# Altium project Offline-programmer-Hardware.PrjPcb
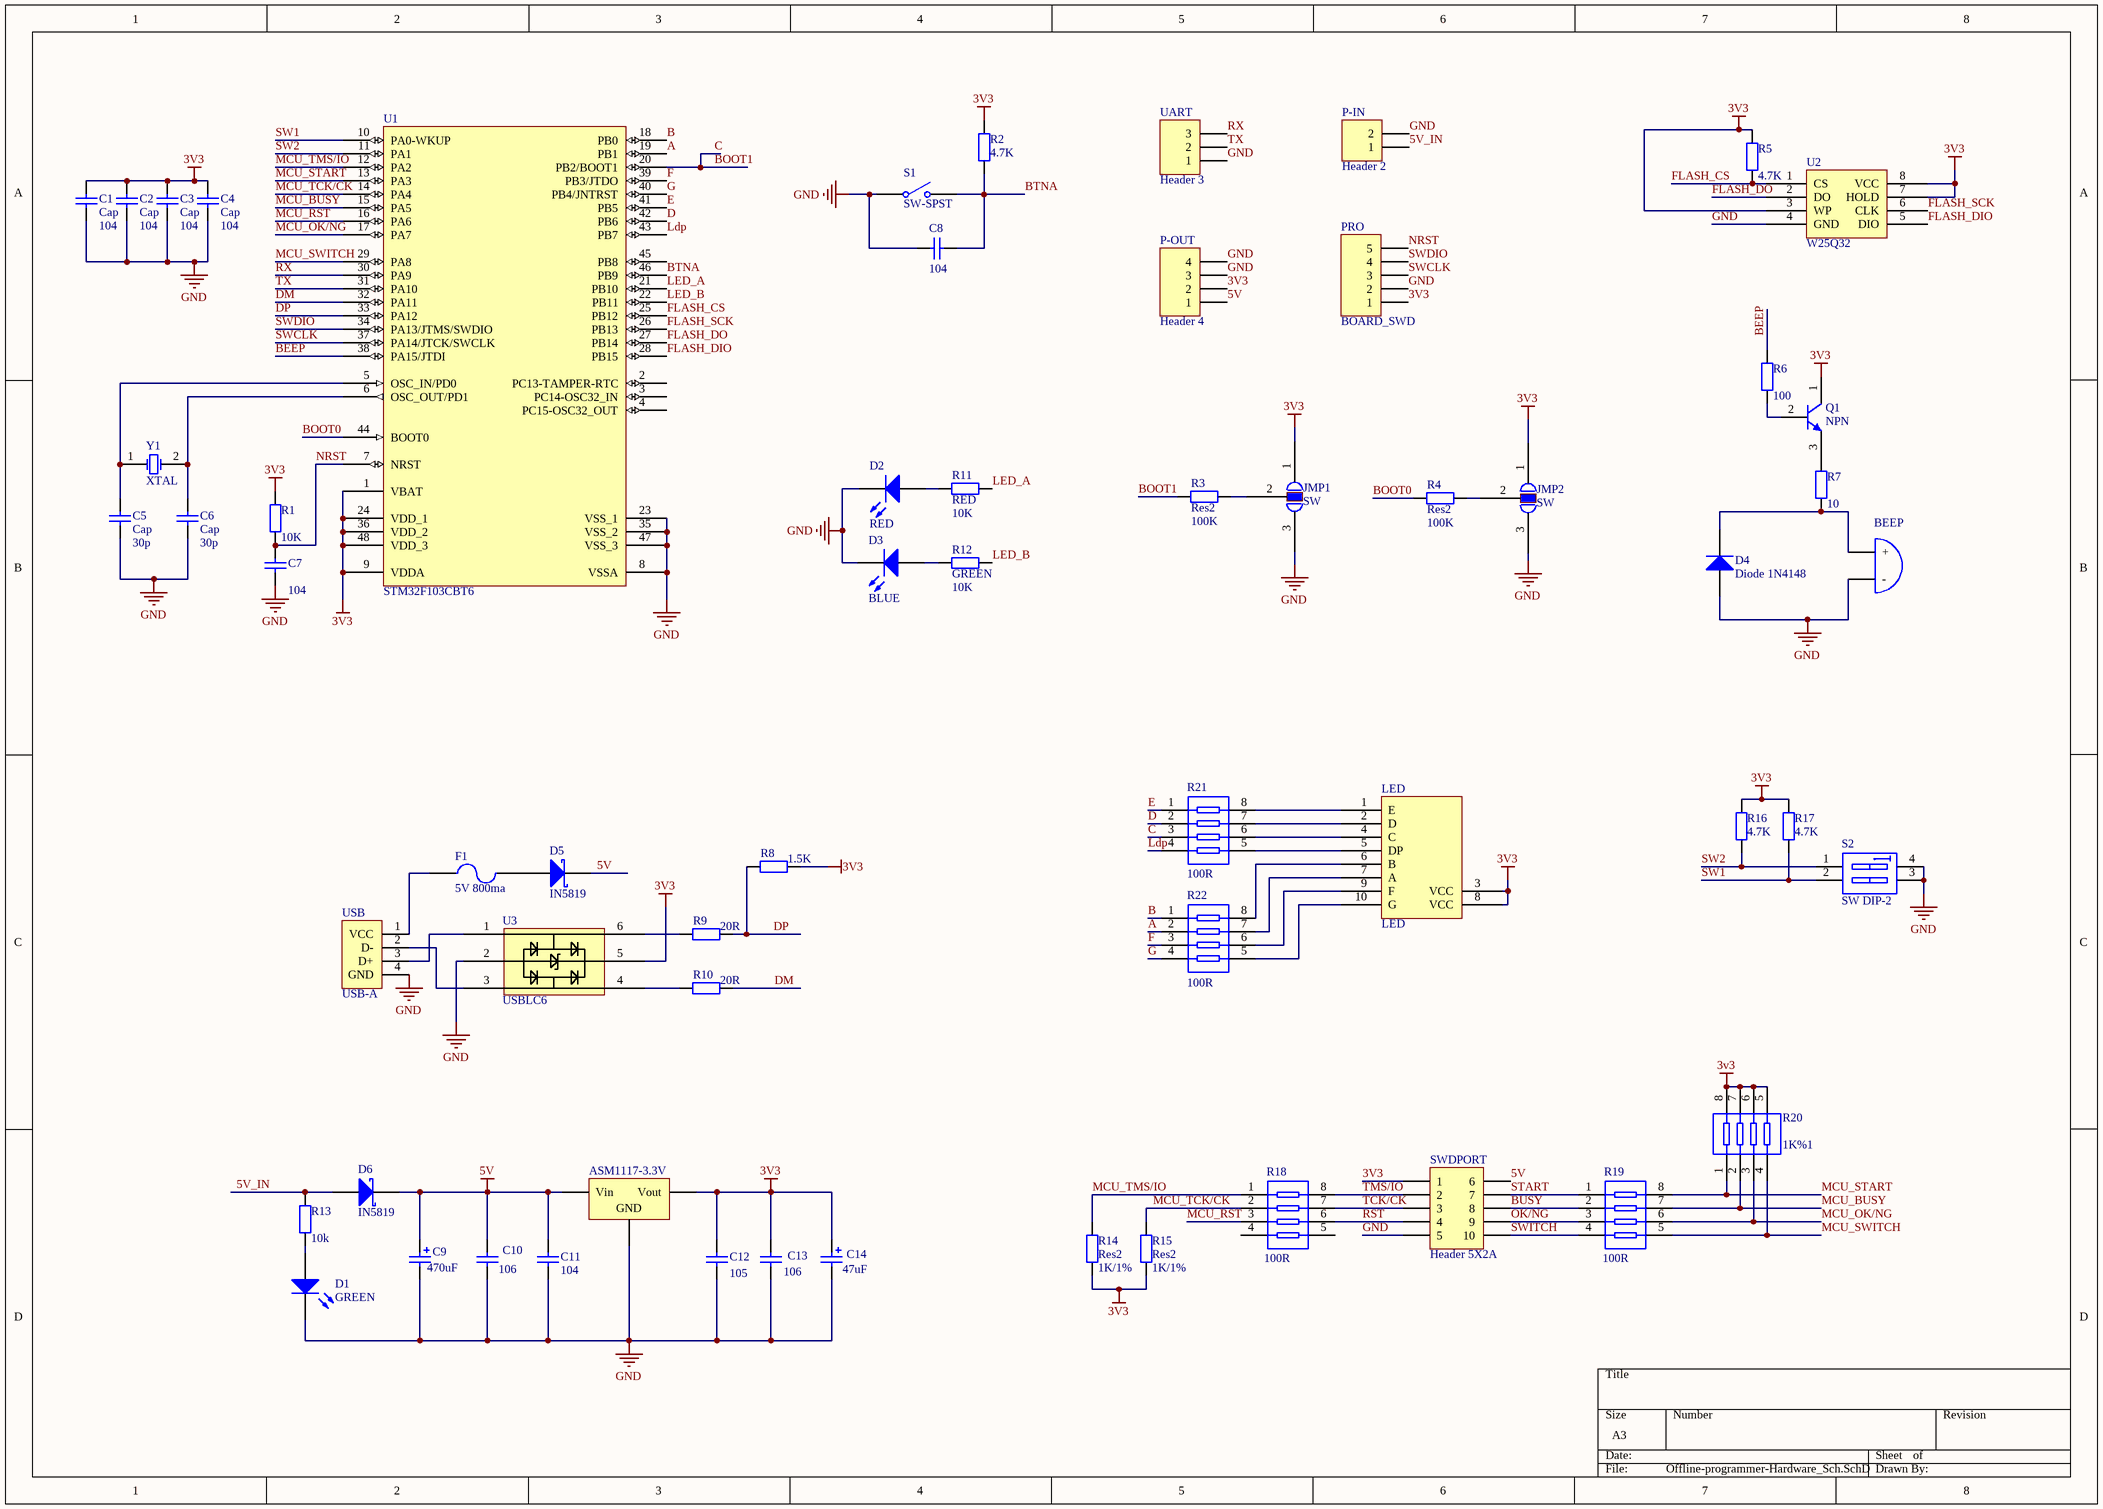
[diagram p0: Offline-programmer-Hardware_Sch.SchDoc]
1 sheet, 61 parts. Net scope: global (net labels, ports and power ports of the same name join across sheets).
Board file: Offline-programmer-Hardware_Pcb.PcbDoc

## Sheet Offline-programmer-Hardware_Sch.SchDoc
size A3

### Parts
ASM1117-3.3V  Volt Reg  [SOT223]  (value not drawn)
BEEP  Bell  [ACC]  (value not drawn)
C1  Cap  value 104  [C0805]
C2  Cap  value 104  [C0805]
C3  Cap  value 104  [C0805]
C4  Cap  value 104  [C0805]
C5  Cap  value 30p  [C0805]
C6  Cap  value 30p  [C0805]
C7  value 104  [C0805]  (hidden comment: Cap)
C8  value 104  [C0805]  (hidden comment: Cap)
C9  value 470uF  [LC-CASE-E_7343]  (hidden comment: Cap Pol2)
C10  value 106  [C0805]  (hidden comment: Cap)
C11  value 104  [C0805]  (hidden comment: Cap)
C12  value 105  [C0805]  (hidden comment: Cap)
C13  value 106  [C0805]  (hidden comment: Cap)
C14  value 47uF  [LC-CASE-C_6032]  (hidden comment: Cap Pol2)
D1  GREEN  [LC-0805_LED_S1]
D2  RED  [LC-0805_LED_S1]
D3  BLUE  [LC-0805_LED_S1]
D4  Diode 1N4148  [SOD123]
D5  IN5819  [SOD123]
D6  IN5819  [SOD123]
F1  5V 800ma  [C0805]
JMP1  SW  [JUMP_PAD]
JMP2  SW  [JUMP_PAD]
LED  LED  [0.2LED]
P-IN  Header 2  [HDR1X2]
P-OUT  Header 4  [HDR1X4]
PRO  BOARD_SWD  [HDR1X5]
Q1  NPN  [SOT-23]
R1  value 10K  [R0805]  (hidden comment: Res2)
R2  value 4.7K  [R0805]  (hidden comment: Res2)
R3  Res2  value 100K  [R0805]
R4  Res2  value 100K  [R0805]
R5  value 4.7K  [R0805]  (hidden comment: Res2)
R6  value 100  [R0805]  (hidden comment: Res2)
R7  value 10  [R0805]  (hidden comment: Res2)
R8  value 1.5K  [R0805]  (hidden comment: Res2)
R9  value 20R  [R0805]  (hidden comment: Res2)
R10  value 20R  [R0805]  (hidden comment: Res2)
R11  RED  value 10K  [R0805]
R12  GREEN  value 10K  [R0805]
R13  value 10k  [R0805]  (hidden comment: Res2)
R14  Res2  value 1K/1%  [R0805]
R15  Res2  value 1K/1%  [R0805]
R16  value 4.7K  [R0805]  (hidden comment: Res2)
R17  value 4.7K  [R0805]  (hidden comment: Res2)
R18  value 100R  [LC-0603_Rx4]  (hidden comment: Res Pack4)
R19  value 100R  [LC-0603_Rx4]  (hidden comment: Res Pack4)
R20  value 1K%1  [LC-0603_Rx4]  (hidden comment: Res Pack4)
R21  value 100R  [LC-0603_Rx4]  (hidden comment: Res Pack4)
R22  value 100R  [LC-0603_Rx4]  (hidden comment: Res Pack4)
S1  SW-SPST  [TSW SMD-3*6*2.5]
S2  SW DIP-2  [SW-4]
SWDPORT  Header 5X2A  [HDR2X5_CEN]
U1  STM32F103CBT6  [TQFP48_L]
U2  W25Q32  [LC-SOP-8_208mil]
U3  USBLC6  [SOT23-6]
UART  Header 3  [HDR1X3]
USB  USB-A  [USB_A/P_A]
Y1  XTAL  [BCY-W2/D3.1]

### Nets
3V3: ASM1117-3.3V.3(Vout) C1.2 C2.2 C3.2 C4.2 C12.2 C13.2 C14.1 JMP1.1 JMP2.1 LED.3(VCC) LED.8(VCC) P-OUT.2 PRO.1 Q1.1(C) R1.2 R2.1 R5.2 R8.1 R14.1 R15.1 R16.1 R17.1 R20.5 R20.6 R20.7 R20.8 SWDPORT.1 U1.1(VBAT) U1.9(VDDA) U1.24(VDD_1) U1.36(VDD_2) U1.48(VDD_3) U2.3(WP) U2.7(HOLD) U2.8(VCC) U3.5
5V: ASM1117-3.3V.1(Vin) C9.1 C10.2 C11.2 D5.2(K) D6.2(K) P-OUT.1 SWDPORT.6
GND: ASM1117-3.3V.2(GND) BEEP.2(-) C1.1 C2.1 C3.1 C4.1 C5.1 C6.1 C7.1 C8.2 C9.2 C10.1 C11.1 C12.1 C13.1 C14.2 D1.2(K) D2.2(K) D3.2(K) D4.1(A) JMP1.3 JMP2.3 P-IN.2 P-OUT.3 P-OUT.4 PRO.2 S1.1(COMMON) S2.3(B2) S2.4(B1) SWDPORT.5 U1.8(VSSA) U1.23(VSS_1) U1.35(VSS_2) U1.47(VSS_3) U2.4(GND) U3.2 UART.1 USB.4(GND)
5V_IN: D6.1(A) P-IN.1 R13.1
A: R22.2 U1.19(PB1)
B: R22.1 U1.18(PB0)
BEEP: R6.1 U1.38(PA15/JTDI)
BOOT0: R4.2 U1.44(BOOT0)
BOOT1: R3.2 R21.3 U1.20(PB2/BOOT1)  [also labelled C]
BTNA: C8.1 R2.2 S1.2(NO) U1.46(PB9)
BUSY: R19.2 SWDPORT.8
D: R21.2 U1.42(PB6)
DM: R10.2 U1.32(PA11)
DP: R8.2 R9.2 U1.33(PA12)
E: R21.1 U1.41(PB5)
F: R22.3 U1.39(PB3/JTDO)
FLASH_CS: R5.1 U1.25(PB12) U2.1(CS)
FLASH_DIO: U1.28(PB15) U2.5(DIO)
FLASH_DO: U1.27(PB14) U2.2(DO)
FLASH_SCK: U1.26(PB13) U2.6(CLK)
G: R22.4 U1.40(PB4/JNTRST)
Ldp: R21.4 U1.43(PB7)
LED_A: R11.1 U1.21(PB10)
LED_B: R12.1 U1.22(PB11)
MCU_BUSY: R19.7 R20.2 U1.15(PA5)
MCU_OK/NG: R19.6 R20.3 U1.17(PA7)
MCU_RST: R18.3 U1.16(PA6)
MCU_START: R19.8 R20.1 U1.13(PA3)
MCU_SWITCH: R19.5 R20.4 U1.29(PA8)
MCU_TCK/CK: R15.2 R18.2 U1.14(PA4)
MCU_TMS/IO: R14.2 R18.1 U1.12(PA2)
NRST: C7.2 PRO.5 R1.1 U1.7(NRST)
OK/NG: R19.3 SWDPORT.9
RST: R18.6 SWDPORT.4
RX: U1.30(PA9) UART.3
START: R19.1 SWDPORT.7
SW1: R17.2 S2.2(A2) U1.10(PA0-WKUP)
SW2: R16.2 S2.1(A1) U1.11(PA1)
SWCLK: PRO.3 U1.37(PA14/JTCK/SWCLK)
SWDIO: PRO.4 U1.34(PA13/JTMS/SWDIO)
SWITCH: R19.4 SWDPORT.10
TCK/CK: R18.7 SWDPORT.3
TMS/IO: R18.8 SWDPORT.2
TX: U1.31(PA10) UART.2
NetBEEP_1: BEEP.1(+) D4.2(K) R7.2
NetC5_2: C5.2 U1.5(OSC_IN/PD0) Y1.1(OSC1)
NetC6_2: C6.2 U1.6(OSC_OUT/PD1) Y1.2(OSC2)
NetD1_1: D1.1(A) R13.2
NetD2_1: D2.1(A) R11.2
NetD3_1: D3.1(A) R12.2
NetD5_1: D5.1(A) F1.2
NetF1_1: F1.1 USB.1(VCC)
NetJMP1_2: JMP1.2 R3.1
NetJMP2_2: JMP2.2 R4.1
NetLED_1: LED.1(E) R21.8
NetLED_2: LED.2(D) R21.7
NetLED_4: LED.4(C) R21.6
NetLED_5: LED.5(DP) R21.5
NetLED_6: LED.6(B) R22.8
NetLED_7: LED.7(A) R22.7
NetLED_9: LED.9(F) R22.6
NetLED_10: LED.10(G) R22.5
NetQ1_2: Q1.2(B) R6.2
NetQ1_3: Q1.3(E) R7.1
NetR9_1: R9.1 U3.6
NetR10_1: R10.1 U3.4
NetU3_1: U3.1 USB.3(D+)
NetU3_3: U3.3 USB.2(D-)

Not connected (* = marked no-connect by the designer): R18 4 5; U1 2(PC13-TAMPER-RTC) 3(PC14-OSC32_IN) 4(PC15-OSC32_OUT) 45(PB8)

### Library data of the parts
ASM1117-3.3V = Volt Reg: Voltage Regulator; pin to pad: 1>3 2>1 3>2; Published: 24-Mar-1999; LatestRevisionDate: 29-May-2009; LatestRevisionNote: IPC-7351 Footprint Added.; PackageReference: D2PAK; Publisher: Altium Limited; PackageDescription: 3-Pin Transistor Outline Package 2.54 mm Pitch, 15.1 mm Lead Span
BEEP = Bell: Electrical Bell; pin to pad: 1>2 2>1; Published: 24-Mar-1999; LatestRevisionDate: 17-Jul-2002; LatestRevisionNote: Re-released for DXP Platform.; PackageReference: PIN2; Publisher: Altium Limited
C1-C8 C10-C13 = Cap: Capacitor; Published: 8-Jun-2000; LatestRevisionDate: 17-Jul-2002; LatestRevisionNote: Re-released for DXP Platform.; PackageReference: RAD-0.3; Publisher: Altium Limited; PackageDescription: Radial Cap, Thru-Hole; 2 Leads; 0.3 in Pin Spacing
C9 C14 = Cap Pol2: Polarized Capacitor (Axial); Published: 8-Jun-2000; LatestRevisionDate: 17-Jul-2002; LatestRevisionNote: Re-released for DXP Platform.; PackageReference: POLAR0.8; Publisher: Altium Limited; PackageDescription: Polarized Capacitor; 2 Leads
D1-D3 = LED0: Typical INFRARED GaAs LED; Published: 8-Jun-2000; LatestRevisionDate: 08-Jul-2005; LatestRevisionNote: Mech Layer 1 removed.; PackageReference: LED-0; Publisher: Altium Limited; PackageDescription: LED; 2 Leads
D4 = Diode 1N4148: High Conductance Fast Diode; Published: 8-Jun-2000; LatestRevisionDate: 17-Jul-2002; LatestRevisionNote: Re-released for DXP Platform.; DatasheetVersion: 1997; PackageReference: DO-35; Publisher: Altium Limited; PackageDescription: Diode, Axial; Body 3.8 x 1.9 mm (LxDia. max), Lead Dia. 0.53 mm (max); Code_JEDEC: DO-204-AH; ComponentLink1Description: Manufacturer Link; ComponentLink1URL: http://www.fairchildsemi.com/; ComponentLink2Description: Datasheet; ComponentLink2URL: http://www.fairchildsemi.com/ds/1N%2F1N4148.pdf
D5 D6 = D Schottky: Schottky Diode; Published: 8-Jun-2000; LatestRevisionDate: 17-Jul-2002; LatestRevisionNote: Re-released for DXP Platform.; PackageReference: SMB; Publisher: Altium Limited; PackageDescription: DO-214-AA/SMB; 2 C-Bend Leads; Body 5.3 x 3.6 mm, inc. leads (LxW); Code_JEDEC: DO-214-AA
F1 = Fuse 2: Fuse; Published: 8-Jun-2000; LatestRevisionDate: 17-Jul-2002; LatestRevisionNote: Re-released for DXP Platform.; PackageReference: PIN-W2/E2.8; Publisher: Altium Limited; PackageDescription: Thru-Hole; 2 Leads
P-IN = Header 2: Header, 2-Pin; LatestRevisionDate: 17-Jul-2002; LatestRevisionNote: Re-released for DXP Platform.; Publisher: Altium Limited
P-OUT = Header 4: Header, 4-Pin; LatestRevisionDate: 17-Jul-2002; LatestRevisionNote: Re-released for DXP Platform.; Publisher: Altium Limited
PRO = Header 5: Header, 5-Pin; LatestRevisionDate: 17-Jul-2002; LatestRevisionNote: Re-released for DXP Platform.; Publisher: Altium Limited
Q1 = NPN: NPN Bipolar Transistor; pin to pad: 1>3 2>1 3>2; Published: 8-Jun-2000; LatestRevisionDate: 17-Jul-2002; LatestRevisionNote: Re-released for DXP Platform.; PackageReference: TO-226-AA; Publisher: Altium Limited; PackageDescription: TO, Flat Index; 3 In-Line, Axial Leads; Body Dia. 4.8mm; Leads 0.55 x 0.51 mm (max); Code_JEDEC: TO-226-AA
R1-R17 = Res2: Resistor; Published: 8-Jun-2000; LatestRevisionDate: 17-Jul-2002; LatestRevisionNote: Re-released for DXP Platform.; PackageReference: AXIAL-0.4; Publisher: Altium Limited; PackageDescription: Axial Device, Thru-Hole; 2 Leads; 0.4 in Pin Spacing
R18-R22 = Res Pack4: Isolated Resistor Network; Published: 24-Mar-1999; LatestRevisionDate: 29-May-2009; LatestRevisionNote: IPC-7351 Footprint Added.; PackageVersion: Oct-2003; PackageReference: SSOP16; Publisher: Altium Limited; PackageDescription: 16-Pin Plastic Small Outline Package 0.65 mm Pitch; Code_JEDEC: MO-150-AC; Code_IPC: SOP65P780-16
S1 = SW-SPST: Single-Pole, Single-Throw Switch; Published: 24-Mar-1999; LatestRevisionDate: 17-Jul-2002; LatestRevisionNote: Re-released for DXP Platform.; PackageReference: SPST-2; Publisher: Altium Limited; PackageDescription: Switch; 2 Leads
S2 = SW DIP-2: DIP Switch, 2 Position, SPST; Published: 24-Mar-1999; LatestRevisionDate: 17-Jul-2002; LatestRevisionNote: Re-released for DXP Platform.; PackageReference: DIP-4; Publisher: Altium Limited
SWDPORT = Header 5X2A: Header, 5-Pin, Dual row; LatestRevisionDate: 17-Jul-2002; LatestRevisionNote: Re-released for DXP Platform.; Publisher: Altium Limited
U1 = STM32F103CBT6: STM32 ARM-based 32-bit MCU with 128 Kbytes Flash, 48-pin LQFP, Industrial Temperature; Published: 30-May-2008; DatasheetVersion: rev6, Mar-2008; PackageVersion: Mar-2008; PackageReference: LQFP48; Publisher: Altium Limited; PackageDescription: 48-Pin Low-Profile Quad Flat Pack, 7 x 7 mm Body, 0.5 mm Pitch (LQFP48); ComponentLink1Description: Manufacturer Link; ComponentLink1URL: www.st.com/stm32; ComponentLink2Description: Datasheet; ComponentLink2URL: http://www.st.com/stonline/products/literature/ds/13587.pdf
UART = Header 3: Header, 3-Pin; LatestRevisionDate: 17-Jul-2002; LatestRevisionNote: Re-released for DXP Platform.; Publisher: Altium Limited
USB = USB-B/S: USB-B型母接口; 版权归属: 源创客; BOM名称: USB-B型母接口; 学习资源: www.ooocke.com
Y1 = XTAL: Crystal Oscillator; Published: 8-Jun-2000; LatestRevisionDate: 17-Jul-2002; LatestRevisionNote: Re-released for DXP Platform.; PackageReference: R38; Publisher: Altium Limited; PackageDescription: Crystal, Thru-Hole; 2 Leads; Body 3.1 x 8.2 mm (Dia.xH)